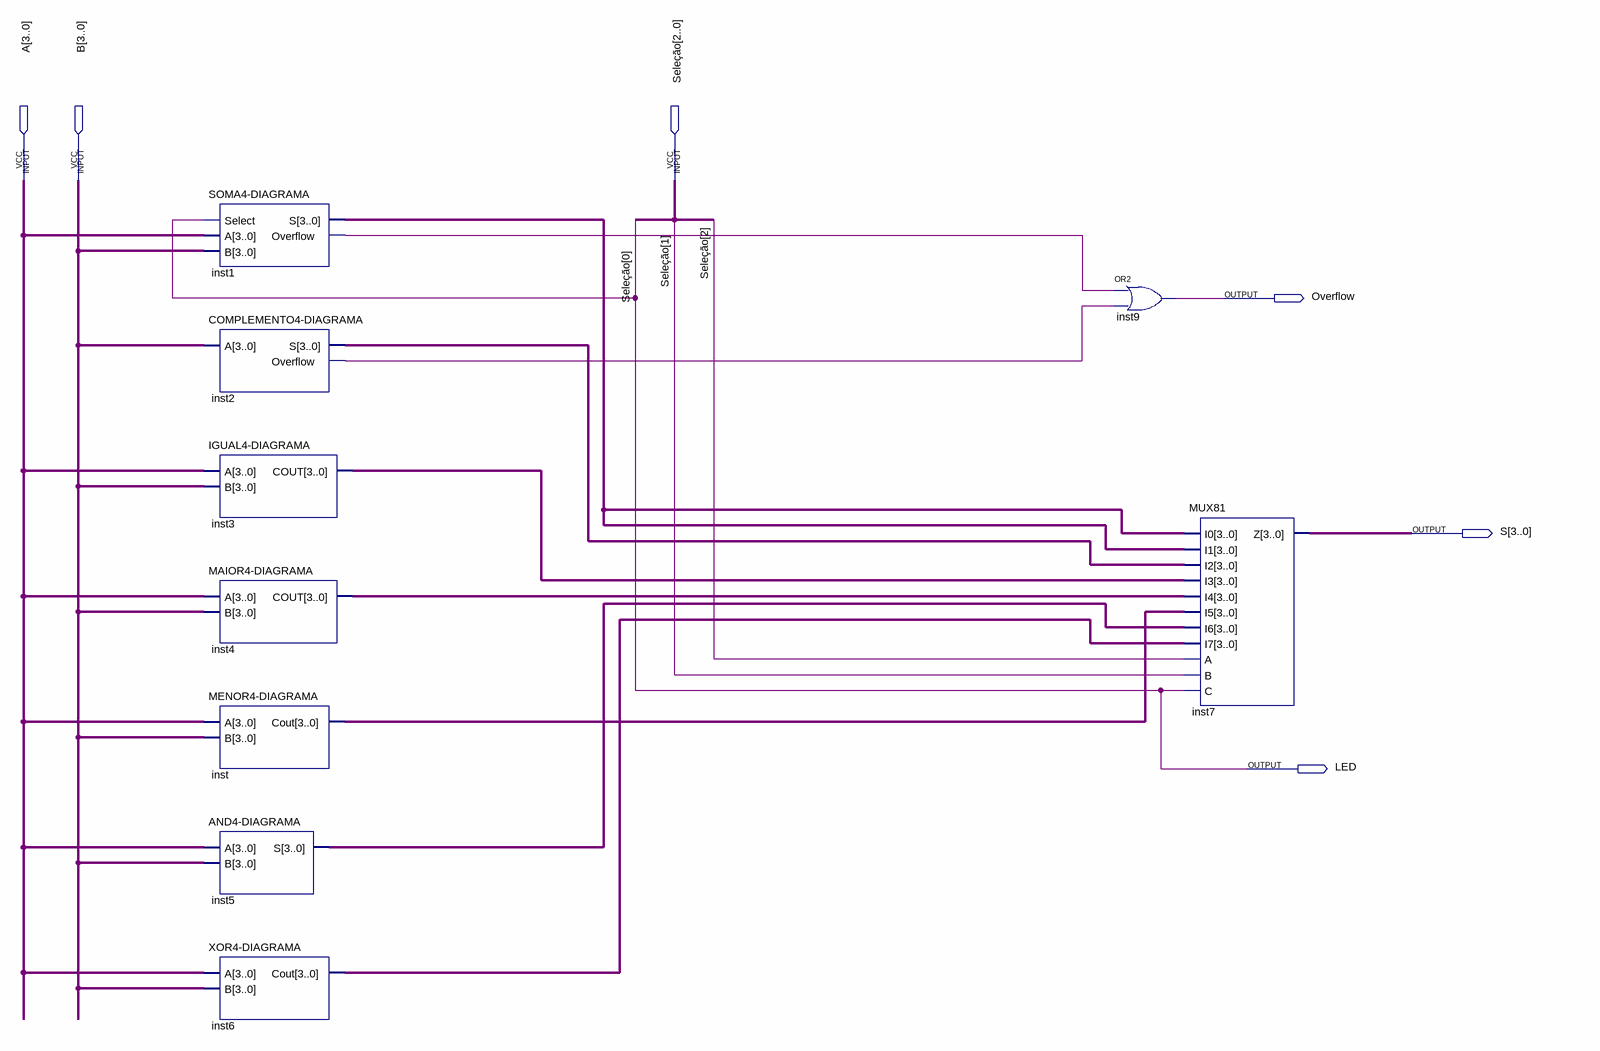
[diagram p0: schematic sheet]
// Quartus schematic ULA-DIAGRAMA.bdf as structural Verilog: 9 symbols, 6 pins
module \ULA-DIAGRAMA  (
  input  [3:0] A,
  input  [3:0] B,
  input  [2:0] \Seleção ,
  output Overflow,
  output [3:0] S,
  output LED
);

  wire inst1_overflow, inst2_overflow;
  wire [3:0] inst1_s, inst2_s, inst3_cout, inst4_cout, inst5_s, inst6_cout, inst_cout;

  \SOMA4-DIAGRAMA  inst1 (.Select(\Seleção [0]), .A(A), .B(B), .S(inst1_s), .Overflow(inst1_overflow));
  \COMPLEMENTO4-DIAGRAMA  inst2 (.A(B), .S(inst2_s), .Overflow(inst2_overflow));
  \IGUAL4-DIAGRAMA  inst3 (.A(A), .B(B), .COUT(inst3_cout));
  \MAIOR4-DIAGRAMA  inst4 (.A(A), .B(B), .COUT(inst4_cout));
  \MENOR4-DIAGRAMA  inst (.A(A), .B(B), .Cout(inst_cout));
  \AND4-DIAGRAMA  inst5 (.A(A), .B(B), .S(inst5_s));
  \XOR4-DIAGRAMA  inst6 (.A(A), .B(B), .Cout(inst6_cout));
  or inst9 (Overflow, inst1_overflow, inst2_overflow);
  MUX81 inst7 (
    .I0(inst1_s), .I1(inst1_s), .I2(inst2_s), .I3(inst3_cout), .I4(inst4_cout), .I5(inst_cout), .I6(inst5_s),
    .I7(inst6_cout), .A(\Seleção [2]), .B(\Seleção [1]), .C(\Seleção [0]), .Z(S));

  assign LED = \Seleção [0];
endmodule
